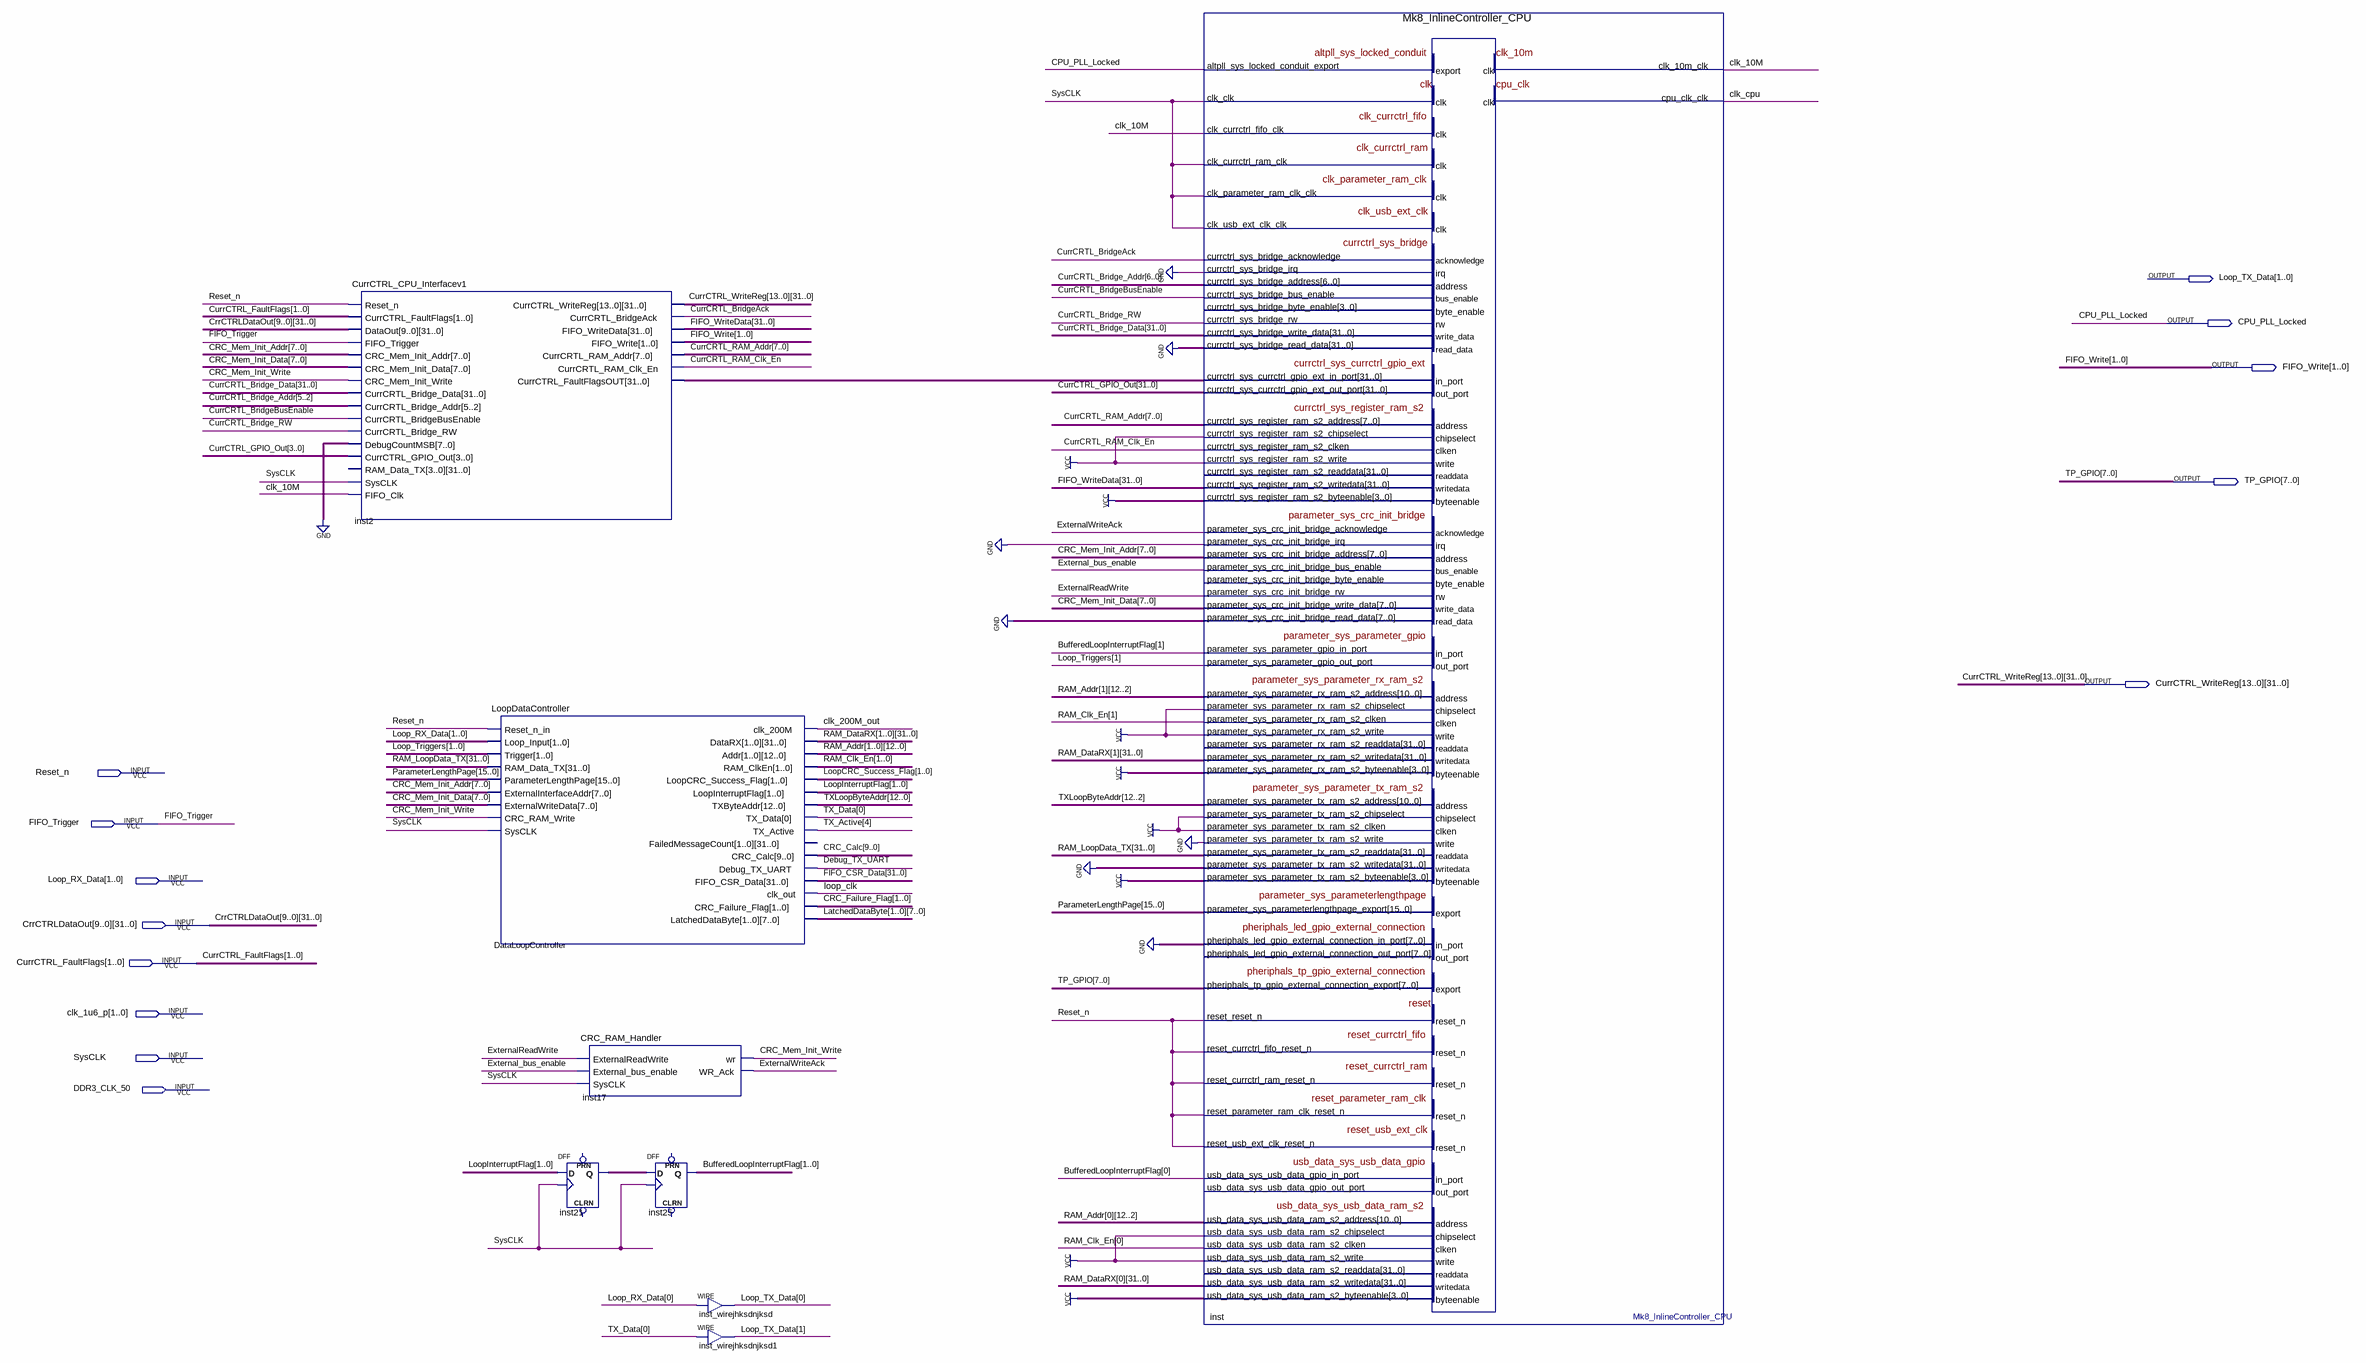
[diagram p0: schematic sheet]
// Quartus schematic CPU_Comms_Blk.bdf as structural Verilog: 8 symbols, 13 pins
module CPU_Comms_Blk (
  input  Reset_n,
  input  FIFO_Trigger,
  input  [1:0] Loop_RX_Data,
  input  [31:0] CrrCTRLDataOut_9,
  input  [31:0] CrrCTRLDataOut_8,
  input  [31:0] CrrCTRLDataOut_7,
  input  [31:0] CrrCTRLDataOut_6,
  input  [31:0] CrrCTRLDataOut_5,
  input  [31:0] CrrCTRLDataOut_4,
  input  [31:0] CrrCTRLDataOut_3,
  input  [31:0] CrrCTRLDataOut_2,
  input  [31:0] CrrCTRLDataOut_1,
  input  [31:0] CrrCTRLDataOut_0,
  input  [1:0] CurrCTRL_FaultFlags,
  input  [1:0] clk_1u6_p,
  input  SysCLK,
  input  DDR3_CLK_50,
  output [1:0] Loop_TX_Data,
  output CPU_PLL_Locked,
  output [1:0] FIFO_Write,
  output [7:0] TP_GPIO,
  output [31:0] CurrCTRL_WriteReg_13,
  output [31:0] CurrCTRL_WriteReg_12,
  output [31:0] CurrCTRL_WriteReg_11,
  output [31:0] CurrCTRL_WriteReg_10,
  output [31:0] CurrCTRL_WriteReg_9,
  output [31:0] CurrCTRL_WriteReg_8,
  output [31:0] CurrCTRL_WriteReg_7,
  output [31:0] CurrCTRL_WriteReg_6,
  output [31:0] CurrCTRL_WriteReg_5,
  output [31:0] CurrCTRL_WriteReg_4,
  output [31:0] CurrCTRL_WriteReg_3,
  output [31:0] CurrCTRL_WriteReg_2,
  output [31:0] CurrCTRL_WriteReg_1,
  output [31:0] CurrCTRL_WriteReg_0
);

  wire clk_10M, clk_200M_out, clk_cpu, CRC_Mem_Init_Write, CurrCRTL_Bridge_RW, CurrCRTL_BridgeAck,
       CurrCRTL_BridgeBusEnable, CurrCRTL_RAM_Clk_En, Debug_TX_UART, External_bus_enable, ExternalReadWrite,
       ExternalWriteAck, loop_clk;
  wire [0:0] TX_Data;
  wire [1:0] BufferedLoopInterruptFlag, CRC_Failure_Flag, inst21_q, Loop_Triggers, LoopCRC_Success_Flag,
       LoopInterruptFlag, RAM_Clk_En;
  wire [4:4] TX_Active;
  wire [6:0] CurrCRTL_Bridge_Addr;
  wire [7:0] CRC_Mem_Init_Addr, CRC_Mem_Init_Data, CurrCRTL_RAM_Addr, LatchedDataByte_0, LatchedDataByte_1;
  wire [9:0] CRC_Calc;
  wire [12:0] RAM_Addr_0, RAM_Addr_1, TXLoopByteAddr;
  wire [15:0] ParameterLengthPage;
  wire [31:0] CurrCRTL_Bridge_Data, CurrCTRL_GPIO_Out, FIFO_CSR_Data, FIFO_WriteData,
       inst2_currctrl_faultflagsout, RAM_DataRX_0, RAM_DataRX_1, RAM_LoopData_TX;

  CurrCTRL_CPU_Interfacev1 inst2 (
    .Reset_n(Reset_n), .CurrCTRL_FaultFlags(CurrCTRL_FaultFlags),
    .DataOut({CrrCTRLDataOut_9, CrrCTRLDataOut_8, CrrCTRLDataOut_7, CrrCTRLDataOut_6, CrrCTRLDataOut_5, CrrCTRLDataOut_4, CrrCTRLDataOut_3, CrrCTRLDataOut_2, CrrCTRLDataOut_1, CrrCTRLDataOut_0}),
    .FIFO_Trigger(FIFO_Trigger), .CRC_Mem_Init_Addr(CRC_Mem_Init_Addr),
    .CRC_Mem_Init_Data(CRC_Mem_Init_Data), .CRC_Mem_Init_Write(CRC_Mem_Init_Write),
    .CurrCRTL_Bridge_Data(CurrCRTL_Bridge_Data), .CurrCRTL_Bridge_Addr(CurrCRTL_Bridge_Addr[5:2]),
    .CurrCRTL_BridgeBusEnable(CurrCRTL_BridgeBusEnable), .CurrCRTL_Bridge_RW(CurrCRTL_Bridge_RW),
    .DebugCountMSB({8{1'b0}}), .CurrCTRL_GPIO_Out(CurrCTRL_GPIO_Out[3:0]), .SysCLK(SysCLK),
    .FIFO_Clk(clk_10M),
    .CurrCTRL_WriteReg({CurrCTRL_WriteReg_13, CurrCTRL_WriteReg_12, CurrCTRL_WriteReg_11, CurrCTRL_WriteReg_10, CurrCTRL_WriteReg_9, CurrCTRL_WriteReg_8, CurrCTRL_WriteReg_7, CurrCTRL_WriteReg_6, CurrCTRL_WriteReg_5, CurrCTRL_WriteReg_4, CurrCTRL_WriteReg_3, CurrCTRL_WriteReg_2, CurrCTRL_WriteReg_1, CurrCTRL_WriteReg_0}),
    .CurrCRTL_BridgeAck(CurrCRTL_BridgeAck), .FIFO_WriteData(FIFO_WriteData), .FIFO_Write(FIFO_Write),
    .CurrCRTL_RAM_Addr(CurrCRTL_RAM_Addr), .CurrCRTL_RAM_Clk_En(CurrCRTL_RAM_Clk_En),
    .CurrCTRL_FaultFlagsOUT(inst2_currctrl_faultflagsout));  // open: RAM_Data_TX
  LoopDataController DataLoopController (
    .Reset_n_in(Reset_n), .Loop_Input(Loop_RX_Data), .Trigger(Loop_Triggers), .RAM_Data_TX(RAM_LoopData_TX),
    .ParameterLengthPage(ParameterLengthPage), .ExternalInterfaceAddr(CRC_Mem_Init_Addr),
    .ExternalWriteData(CRC_Mem_Init_Data), .CRC_RAM_Write(CRC_Mem_Init_Write), .SysCLK(SysCLK),
    .clk_200M(clk_200M_out), .DataRX({RAM_DataRX_1, RAM_DataRX_0}), .Addr({RAM_Addr_1, RAM_Addr_0}),
    .RAM_ClkEn(RAM_Clk_En), .LoopCRC_Success_Flag(LoopCRC_Success_Flag),
    .LoopInterruptFlag(LoopInterruptFlag), .TXByteAddr(TXLoopByteAddr), .TX_Data(TX_Data[0]),
    .TX_Active(TX_Active[4]), .CRC_Calc(CRC_Calc), .Debug_TX_UART(Debug_TX_UART),
    .FIFO_CSR_Data(FIFO_CSR_Data), .clk_out(loop_clk), .CRC_Failure_Flag(CRC_Failure_Flag),
    .LatchedDataByte({LatchedDataByte_1, LatchedDataByte_0}));  // open: FailedMessageCount
  DFF inst21[1:0] (.CLK(SysCLK), .D(LoopInterruptFlag), .Q(inst21_q));  // open: CLRN, PRN
  CRC_RAM_Handler inst17 (
    .ExternalReadWrite(ExternalReadWrite), .External_bus_enable(External_bus_enable), .SysCLK(SysCLK),
    .wr(CRC_Mem_Init_Write), .WR_Ack(ExternalWriteAck));
  DFF inst25[1:0] (.CLK(SysCLK), .D(inst21_q), .Q(BufferedLoopInterruptFlag));  // open: CLRN, PRN
  assign Loop_TX_Data[0] = Loop_RX_Data[0];  // WIRE inst_wirejhksdnjksd
  assign Loop_TX_Data[1] = TX_Data[0];  // WIRE inst_wirejhksdnjksd1
  Mk8_InlineController_CPU inst (
    .clk_clk(SysCLK), .clk_currctrl_fifo_clk(clk_10M), .clk_currctrl_ram_clk(SysCLK),
    .clk_parameter_ram_clk_clk(SysCLK), .clk_usb_ext_clk_clk(SysCLK),
    .currctrl_sys_bridge_acknowledge(CurrCRTL_BridgeAck), .currctrl_sys_bridge_irq(1'b0),
    .currctrl_sys_bridge_read_data({32{1'b0}}),
    .currctrl_sys_currctrl_gpio_ext_in_port(inst2_currctrl_faultflagsout),
    .currctrl_sys_register_ram_s2_address(CurrCRTL_RAM_Addr), .currctrl_sys_register_ram_s2_chipselect(1'b1),
    .currctrl_sys_register_ram_s2_clken(CurrCRTL_RAM_Clk_En), .currctrl_sys_register_ram_s2_write(1'b1),
    .currctrl_sys_register_ram_s2_writedata(FIFO_WriteData),
    .currctrl_sys_register_ram_s2_byteenable(4'b1111),
    .parameter_sys_crc_init_bridge_acknowledge(ExternalWriteAck), .parameter_sys_crc_init_bridge_irq(1'b0),
    .parameter_sys_crc_init_bridge_read_data({8{1'b0}}),
    .parameter_sys_parameter_gpio_in_port(BufferedLoopInterruptFlag[1]),
    .parameter_sys_parameter_rx_ram_s2_address(RAM_Addr_1[12:2]),
    .parameter_sys_parameter_rx_ram_s2_chipselect(1'b1),
    .parameter_sys_parameter_rx_ram_s2_clken(RAM_Clk_En[1]), .parameter_sys_parameter_rx_ram_s2_write(1'b1),
    .parameter_sys_parameter_rx_ram_s2_writedata(RAM_DataRX_1),
    .parameter_sys_parameter_rx_ram_s2_byteenable(4'b1111),
    .parameter_sys_parameter_tx_ram_s2_address(TXLoopByteAddr[12:2]),
    .parameter_sys_parameter_tx_ram_s2_chipselect(1'b1), .parameter_sys_parameter_tx_ram_s2_clken(1'b1),
    .parameter_sys_parameter_tx_ram_s2_write(1'b0), .parameter_sys_parameter_tx_ram_s2_writedata({32{1'b0}}),
    .parameter_sys_parameter_tx_ram_s2_byteenable(4'b1111),
    .pheriphals_led_gpio_external_connection_in_port({8{1'b0}}), .reset_reset_n(Reset_n),
    .reset_currctrl_fifo_reset_n(Reset_n), .reset_currctrl_ram_reset_n(Reset_n),
    .reset_parameter_ram_clk_reset_n(Reset_n), .reset_usb_ext_clk_reset_n(Reset_n),
    .usb_data_sys_usb_data_gpio_in_port(BufferedLoopInterruptFlag[0]),
    .usb_data_sys_usb_data_ram_s2_address(RAM_Addr_0[12:2]), .usb_data_sys_usb_data_ram_s2_chipselect(1'b1),
    .usb_data_sys_usb_data_ram_s2_clken(RAM_Clk_En[0]), .usb_data_sys_usb_data_ram_s2_write(1'b1),
    .usb_data_sys_usb_data_ram_s2_writedata(RAM_DataRX_0), .usb_data_sys_usb_data_ram_s2_byteenable(4'b1111),
    .altpll_sys_locked_conduit_export(CPU_PLL_Locked), .clk_10m_clk(clk_10M), .cpu_clk_clk(clk_cpu),
    .currctrl_sys_bridge_address(CurrCRTL_Bridge_Addr),
    .currctrl_sys_bridge_bus_enable(CurrCRTL_BridgeBusEnable), .currctrl_sys_bridge_rw(CurrCRTL_Bridge_RW),
    .currctrl_sys_bridge_write_data(CurrCRTL_Bridge_Data),
    .currctrl_sys_currctrl_gpio_ext_out_port(CurrCTRL_GPIO_Out),
    .parameter_sys_crc_init_bridge_address(CRC_Mem_Init_Addr),
    .parameter_sys_crc_init_bridge_bus_enable(External_bus_enable),
    .parameter_sys_crc_init_bridge_rw(ExternalReadWrite),
    .parameter_sys_crc_init_bridge_write_data(CRC_Mem_Init_Data),
    .parameter_sys_parameter_gpio_out_port(Loop_Triggers[1]),
    .parameter_sys_parameter_tx_ram_s2_readdata(RAM_LoopData_TX),
    .parameter_sys_parameterlengthpage_export(ParameterLengthPage),
    .pheriphals_tp_gpio_external_connection_export(TP_GPIO));  // open: currctrl_sys_bridge_byte_enable, currctrl_sys_register_ram_s2_readdata, parameter_sys_crc_init_bridge_byte_enable, parameter_sys_parameter_rx_ram_s2_readdata, pheriphals_led_gpio_external_connection_out_port, usb_data_sys_usb_data_gpio_out_port, usb_data_sys_usb_data_ram_s2_readdata
endmodule
